# EAGLE design nes_visualization (EAGLE 6.4)
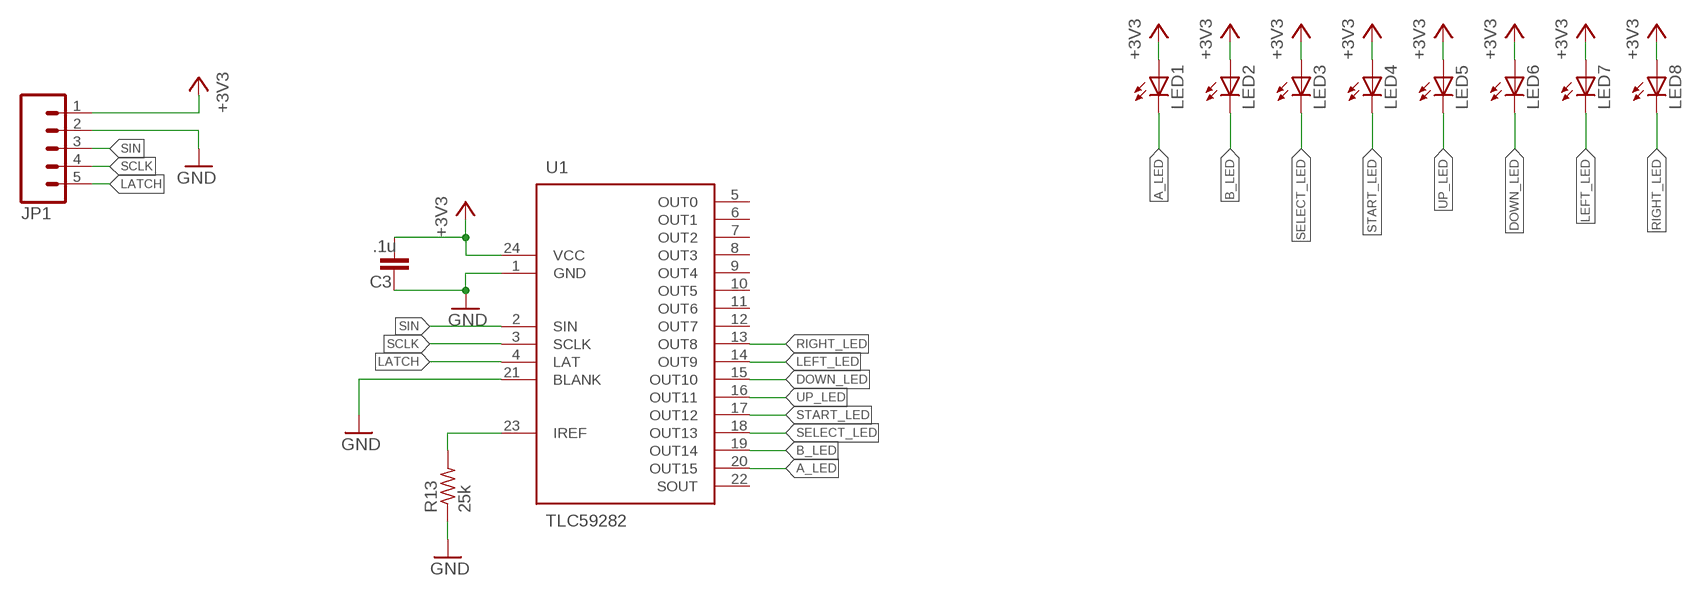
[diagram p0: schematic, sheet 1]

## Parts
C3  .1u  C-EUC0603  [C0603]
JP1  M05PTH  [1X05]
LED1  LED5MM  [LED5MM]
LED2  LED5MM  [LED5MM]
LED3  LED3MM  [LED3MM]
LED4  LED3MM  [LED3MM]
LED5  LED5MM  [LED5MM]
LED6  LED5MM  [LED5MM]
LED7  LED5MM  [LED5MM]
LED8  LED5MM  [LED5MM]
R13  25k  R-US_R0805  [R0805]
U1  TLC59282  [R-PDSO-G24]

## Nets
+3V3: C3.1 JP1.1 LED1.A LED2.A LED3.A LED4.A LED5.A LED6.A LED7.A LED8.A U1.24(VCC)
A_LED: LED1.K(C) U1.20(OUT15)
B_LED: LED2.K(C) U1.19(OUT14)
DOWN_LED: LED6.K(C) U1.15(OUT10)
GND: C3.2 JP1.2 R13.1 U1.1(GND) U1.21(BLANK)
LATCH: JP1.5 U1.4(LAT)
LEFT_LED: LED7.K(C) U1.14(OUT9)
N$5: R13.2 U1.23(IREF)
RIGHT_LED: LED8.K(C) U1.13(OUT8)
SCLK: JP1.4 U1.3(SCLK)
SELECT_LED: LED3.K(C) U1.18(OUT13)
SIN: JP1.3 U1.2(SIN)
START_LED: LED4.K(C) U1.17(OUT12)
UP_LED: LED5.K(C) U1.16(OUT11)
Unconnected: U1.5(OUT0) U1.6(OUT1) U1.7(OUT2) U1.8(OUT3) U1.9(OUT4) U1.10(OUT5) U1.11(OUT6) U1.12(OUT7) U1.22(SOUT)

## Library data of the parts
C3 = rcl:C-EU: CAPACITOR, European symbol; MOUSER#: 80-C0603C104K5R
JP1 = SparkFun-Connectors:M05: Header 5 Standard 5-pin 0.1" header. Use with straight break away headers (SKU : PRT-00116), right angle break away headers (PRT-00553), swiss pins (PRT-00743), machine pins (PRT-00117), and female headers (PRT-00115). Molex polarized connector foot print use with SKU : PRT-08230 with associated crimp pins and housings.
LED1-LED8 = led:LED: LED OSRAM: - CHIPLED LG R971, LG N971, LY N971, LG Q971, LY Q971, LO R971, LY R971 LH N974, LH R974 LS Q976, LO Q976, LY Q976 LO Q996 - Hyper CHIPLED LW Q18S LB Q993, LB Q99A, LB R99A - SideLED LS A670, LO A670, LY A670, LG A670, LP A670 LB A673, LV A673, LT A673, LW A673 LH A674 LY A675 LS A676, LA A676, LO A676, LY A676, LW A676 LS A679, LY A679, LG A679 - Hyper Micro SIDELED® LS Y876, LA Y876, LO Y876, LY Y876 LT Y87S - SmartLED LW L88C, LW L88S LB L89C, LB L89S, LG L890 LS L89K, LO L89K, LY L89K LS L896, LA L896, LO L896, LY L896 - TOPLED LS T670, LO T670, LY T670, LG T670, LP T670 LSG T670, LSP T670, LSY T670, LOP T670, LYG T670 LG T671, LOG T671, LSG T671 LB T673, LV T673, LT T673, LW T673 LH T674 LS T676, LA T676, LO T676, LY T676, LB T676, LH T676, LSB T676, LW T676 LB T67C, LV T67C, LT T67C, LS T67K, LO T67K, LY T67K, LW E67C LS E67B, LA E67B, LO E67B, LY E67B, LB E67C, LV E67C, LT E67C LW T67C LS T679, LY T679, LG T679 LS T770, LO T770, LY T770, LG T770, LP T770 LB T773, LV T773, LT T773, LW T773 LH T774 LS E675, LA E675, LY E675, LS T675 LS T776, LA T776, LO T776, LY T776, LB T776 LHGB T686 LT T68C, LB T68C - Hyper Mini TOPLED® LB M676 - Mini TOPLED Santana® LG M470 LS M47K, LO M47K, LY M47K Source: http://www.osram.convergy.de LUXEON: - LUMILED® LXK2-PW12-R00, LXK2-PW12-S00, LXK2-PW14-U00, LXK2-PW14-V00 LXK2-PM12-R00, LXK2-PM12-S00, LXK2-PM14-U00 LXK2-PE12-Q00, LXK2-PE12-R00, LXK2-PE12-S00, LXK2-PE14-T00, LXK2-PE14-U00 LXK2-PB12-K00, LXK2-PB12-L00, LXK2-PB12-M00, LXK2-PB14-N00, LXK2-PB14-P00, LXK2-PB14-Q00 LXK2-PR12-L00, LXK2-PR12-M00, LXK2-PR14-Q00, LXK2-PR14-R00 LXK2-PD12-Q00, LXK2-PD12-R00, LXK2-PD12-S00 LXK2-PH12-R00, LXK2-PH12-S00 LXK2-PL12-P00, LXK2-PL12-Q00, LXK2-PL12-R00 Source: www.luxeon.com KINGBRIGHT: KA-3528ASYC Source: www.kingbright.com
R13 = rcl:R-US_: RESISTOR, American symbol
U1 = TASLink:TLC59282

## Board
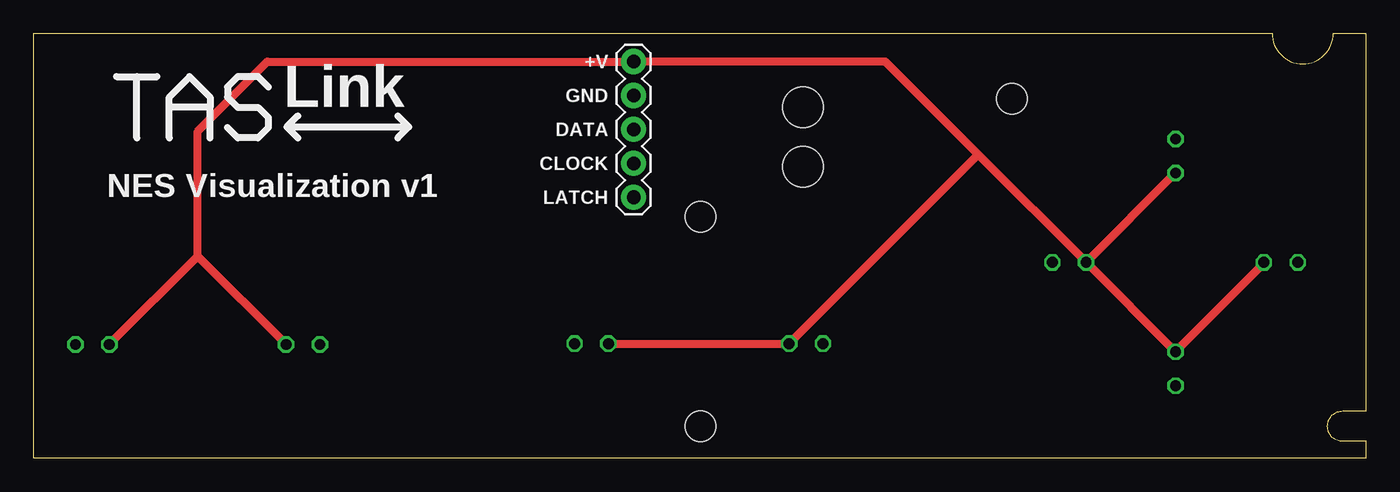
[diagram p1: board, top side]
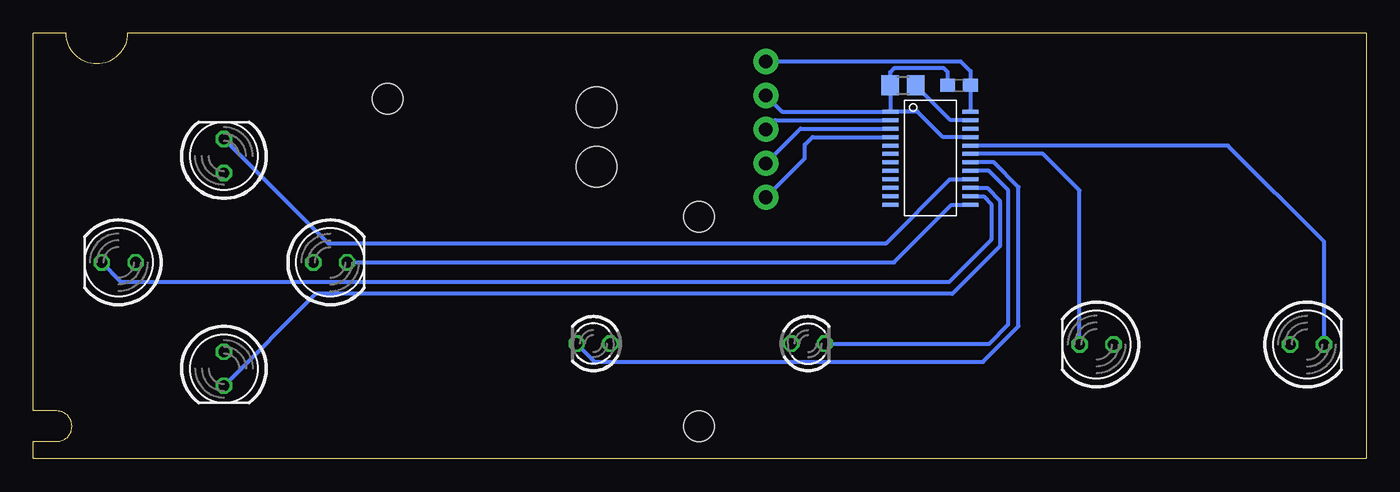
[diagram p2: board, bottom side, seen from below]

Size 99.82 x 31.83 mm. Coordinates in mm from the lower left corner, seen from the top.
Outline: 99.82,0 0,0 0,31.83 92.79,31.83 arc180 97.36,31.83 99.82,31.83 99.82,3.56 98.07,3.56 arc90 96.93,2.41 arc90 98.07,1.27 99.82,1.27 99.82,0
Copper layers (1*16): Top 0.0356mm / dielectric 1.5011mm / Bottom 0.0356mm
Design rules "LaenPCBOrder *": minimum track width 6mil, minimum drill 13mil, track to track 6mil, track to pad 6mil, pad to pad 6mil, via to via 6mil, smd to smd 6mil, copper to edge 15mil, drill to drill 6mil, minimum pad ring 7mil, minimum via ring 7mil, stop-mask expansion 3mil, vias tented up to drill 0mil, thermal gap 10mil
Holes 2.29 mm at 49.96,2.41 49.96,18.11 73.28,26.92
Holes 3.05 mm at 57.66,26.29 57.66,21.84

### Footprints (pad centres in the part's own frame; a part is rotated, then mirrored left to right if it is on the bottom)
C0603 = smd 1.1 x 1: 1 -0.85,0; 2 0.85,0
1X05 = drill 1.016 pad 1.88: 1 0,0; 2 2.54,0; 3 5.08,0; 4 7.62,0; 5 10.16,0
LED5MM = drill 0.813 octagon: A -1.27,0; K 1.27,0
LED3MM = drill 0.813 octagon: A -1.27,0; K 1.27,0
R0805 = smd 1.3 x 1.5: 1 -0.95,0; 2 0.95,0
R-PDSO-G24 = smd 0.3 x 1.2: 1 -3.493,-3; 2 -2.857,-3; 3 -2.223,-3; 4 -1.587,-3; 5 -0.953,-3; 6 -0.318,-3; 7 0.318,-3; 8 0.953,-3; 9 1.587,-3; 10 2.223,-3; 11 2.857,-3; 12 3.493,-3; 13 3.493,3; 14 2.857,3; 15 2.223,3; 16 1.587,3; 17 0.953,3; 18 0.318,3; 19 -0.318,3; 20 -0.953,3; 21 -1.587,3; 22 -2.223,3; 23 -2.857,3; 24 -3.493,3

### Placement (x,y rotation side)
C3  30.49,27.94 180 bottom
JP1  44.96,29.72 270 top
LED1  4.42,8.53 0 bottom
LED2  20.19,8.53 180 bottom
LED3  57.87,8.6 180 bottom
LED4  41.8,8.6 0 bottom
LED5  85.55,22.64 90 bottom
LED6  85.55,6.72 270 bottom
LED7  93.43,14.68 180 bottom
LED8  77.58,14.68 0 bottom
R13  34.69,27.94 0 bottom
U1  32.64,22.48 270 bottom

### Tracks (layer width: path | path; a pad name or v marks a point on that pad's centre or on a via)
+3V3
  Top 0.61: 85.55,21.3 LED5.A LED8.A | 12.31,15.15 LED1.A | LED2.A 12.31,15.15 | 12.31,15.15 12.31,24.5 17.53,29.72 JP1.1 63.82,29.72 70.83,22.7 | 70.83,22.7 LED8.A | 70.83,22.7 70.71,22.7 LED3.A LED4.A | LED8.A LED6.A 92.16,14.61 LED7.A
  Bottom 0.305: U1.24 C3.1 29.64,29 30.35,29.72 JP1.1
A_LED
  Bottom 0.305: LED1.K 3.15,16.23 10.35,23.43 U1.20
B_LED
  Bottom 0.305: LED2.K 21.46,20.07 24.19,22.8 U1.19
DOWN_LED
  Bottom 0.305: U1.15 28.38,20.26 27.43,19.3 27.43,15.88 30.99,12.32 78.68,12.32 LED6.K
GND
  Bottom 0.305: JP1.2 43.75,25.97 U1.1 | U1.21 31.69,24.07 33.59,25.97 U1.1 | U1.1 R13.1 35.64,28.93 35.35,29.21 31.62,29.21 31.34,28.93 C3.2
LATCH
  Bottom 0.305: JP1.5 42.04,22.48 42.04,23.5 41.47,24.07 U1.4
LEFT_LED
  Bottom 0.305: U1.14 28.64,19.62 28.07,19.05 28.07,16.38 31.24,13.21 93.23,13.21 LED7.K
N$5
  Bottom 0.305: U1.23 31.14,25.34 R13.2
RIGHT_LED
  Bottom 0.305: LED8.K 35.36,14.68 31.05,18.99 U1.13
SCLK
  Bottom 0.305: JP1.4 42.35,24.7 U1.3
SELECT_LED
  Bottom 0.305: LED3.K 57.78,7.24 28.7,7.24 26.04,9.91 26.04,20.32 27.88,22.16 U1.18
SIN
  Bottom 0.305: JP1.3 44.26,25.34 U1.2
START_LED
  Bottom 0.305: LED4.K 28.23,8.6 26.8,10.03 26.8,20.07 28.26,21.53 U1.17
UP_LED
  Bottom 0.305: LED5.K 77.76,16.13 35.94,16.13 31.18,20.89 U1.16

### Text on the board
tPlace: +V | GND | Link | DATA | CLOCK | NES Visualization v1 | LATCH